# Altium schematic sheet NRF24_Tester.SchDoc
size A4
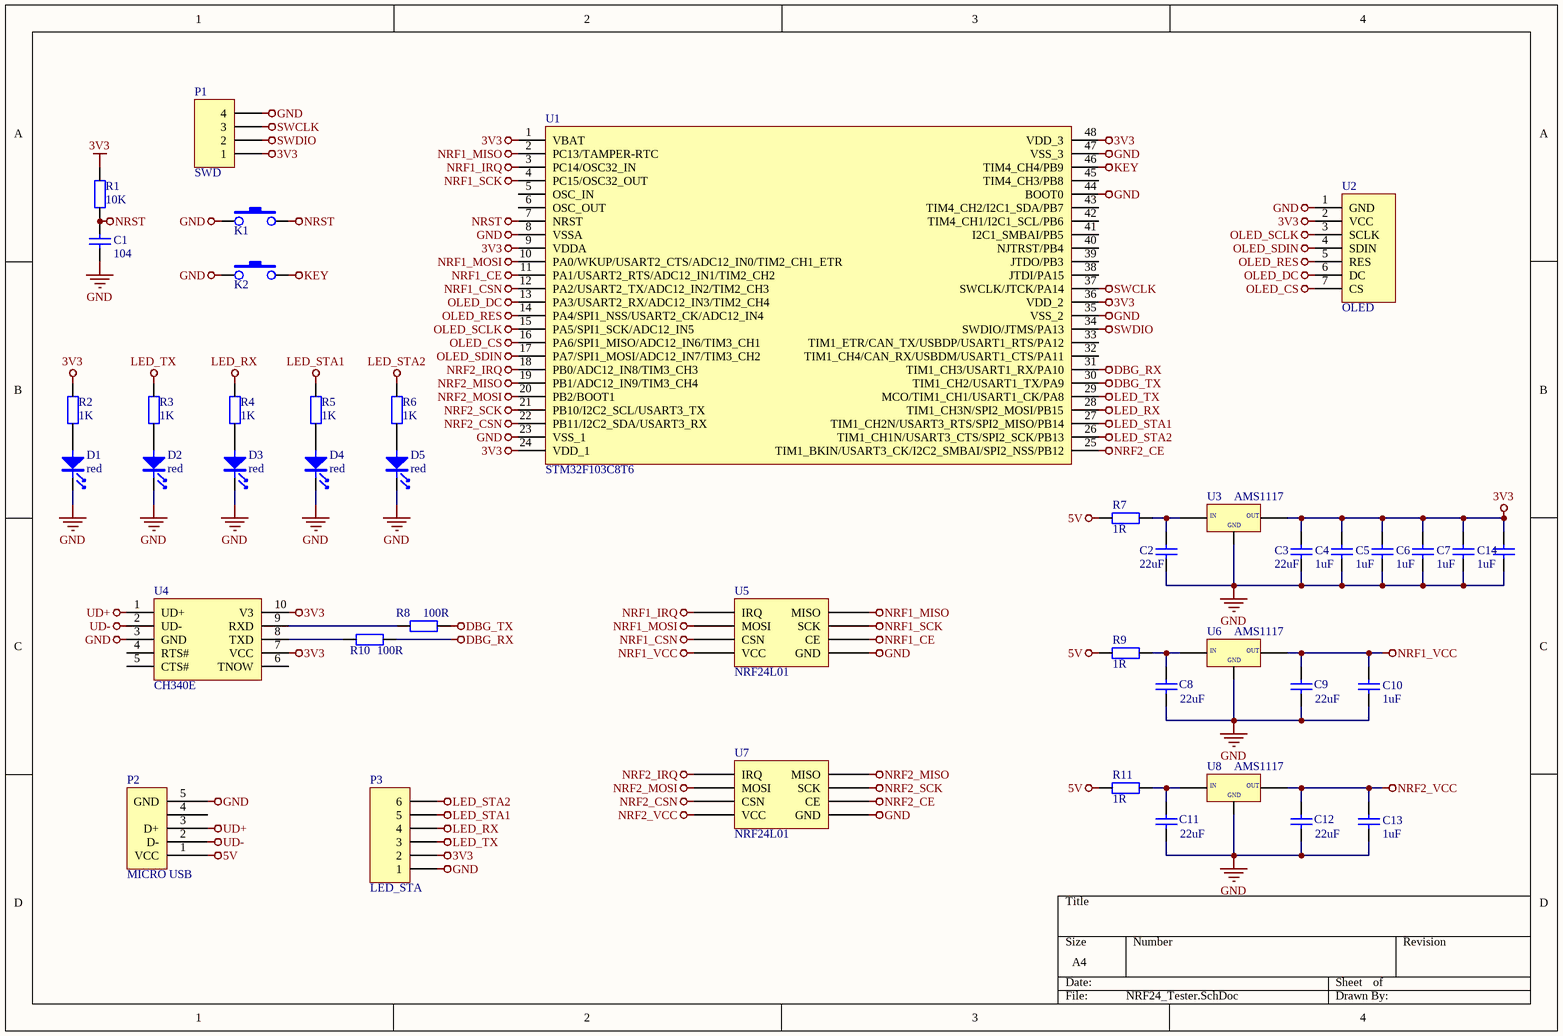
[diagram p0: NRF24_Tester.SchDoc]

## Parts
C1  104  [电容_C0603]
C2  22uF  [电容_C1206]
C3  22uF  [电容_C1206]
C4  1uF  [电容_C0603]
C5  1uF  [电容_C0603]
C6  1uF  [电容_C0603]
C7  1uF  [电容_C0603]
C8  22uF  [电容_C1206]
C9  22uF  [电容_C1206]
C10  1uF  [电容_C0603]
C11  22uF  [电容_C1206]
C12  22uF  [电容_C1206]
C13  1uF  [电容_C0603]
C14  1uF  [电容_C0603]
D1  red  [LED_0603]
D2  red  [LED_0603]
D3  red  [LED_0603]
D4  red  [LED_0603]
D5  red  [LED_0603]
K1  SKRP  [开关按键_SKRP]  (value not drawn)
K2  SKRP  [开关按键_SKRP]  (value not drawn)
P1  SWD  [HDR1X4]
P2  MICRO USB  [接插件_MICRO 牛角插座 USB 直边]
P3  LED_STA  [HDR1X6]
R1  10K  [电阻_R0603]
R2  1K  [电阻_R0603]
R3  1K  [电阻_R0603]
R4  1K  [电阻_R0603]
R5  1K  [电阻_R0603]
R6  1K  [电阻_R0603]
R7  1R  [电阻_R0603]
R8  100R  [电阻_R0603]
R9  1R  [电阻_R0603]
R10  100R  [电阻_R0603]
R11  1R  [电阻_R0603]
U1  STM32F103C8T6  [ST主控_LQFP48]
U2  OLED  [Display_OLED 12864 7pin]
U3  AMS1117  [稳压芯片_SOT-223]
U4  CH340E  [串口_MSOP10]
U5  NRF24L01  [HDR2X4]
U6  AMS1117  [稳压芯片_SOT-223]
U7  NRF24L01  [HDR2X4]
U8  AMS1117  [稳压芯片_SOT-223]

## Nets
3V3: C3.2 C4.2 C5.2 C6.2 C7.2 C14.2 P1.1 P3.2 R1.2 R2.1 U1.1(VBAT) U1.9(VDDA) U1.24(VDD_1) U1.36(VDD_2) U1.48(VDD_3) U2.2(VCC) U3.2(OUT) U4.7(VCC) U4.10(V3)
5V: P2.1(VCC) R7.2 R9.2 R11.2
DBG_RX: R10.1 U1.31(TIM1_CH3/USART1_RX/PA10)
DBG_TX: R8.1 U1.30(TIM1_CH2/USART1_TX/PA9)
GND: C1.1 C2.1 C3.1 C4.1 C5.1 C6.1 C7.1 C8.1 C9.1 C10.1 C11.1 C12.1 C13.1 C14.1 D1.K D2.K D3.K D4.K D5.K K1.1 K2.1 P1.4 P2.0 P2.5(GND) P3.1 U1.8(VSSA) U1.23(VSS_1) U1.35(VSS_2) U1.44(BOOT0) U1.47(VSS_3) U2.1(GND) U3.1(GND) U4.3(GND) U5.1(GND) U6.1(GND) U7.1(GND) U8.1(GND)
KEY: K2.2 U1.46(TIM4_CH4/PB9)
LED_RX: P3.4 R4.1 U1.28(TIM1_CH3N/SPI2_MOSI/PB15)
LED_STA1: P3.5 R5.1 U1.27(TIM1_CH2N/USART3_RTS/SPI2_MISO/PB14)
LED_STA2: P3.6 R6.1 U1.26(TIM1_CH1N/USART3_CTS/SPI2_SCK/PB13)
LED_TX: P3.3 R3.1 U1.29(MCO/TIM1_CH1/USART1_CK/PA8)
NRF1_CE: U1.11(PA1/USART2_RTS/ADC12_IN1/TIM2_CH2) U5.3(CE)
NRF1_CSN: U1.12(PA2/USART2_TX/ADC12_IN2/TIM2_CH3) U5.4(CSN)
NRF1_IRQ: U1.3(PC14/OSC32_IN) U5.8(IRQ)
NRF1_MISO: U1.2(PC13/TAMPER-RTC) U5.7(MISO)
NRF1_MOSI: U1.10(PA0/WKUP/USART2_CTS/ADC12_IN0/TIM2_CH1_ETR) U5.6(MOSI)
NRF1_SCK: U1.4(PC15/OSC32_OUT) U5.5(SCK)
NRF1_VCC: C9.2 C10.2 U5.2(VCC) U6.2(OUT)
NRF2_CE: U1.25(TIM1_BKIN/USART3_CK/I2C2_SMBAI/SPI2_NSS/PB12) U7.3(CE)
NRF2_CSN: U1.22(PB11/I2C2_SDA/USART3_RX) U7.4(CSN)
NRF2_IRQ: U1.18(PB0/ADC12_IN8/TIM3_CH3) U7.8(IRQ)
NRF2_MISO: U1.19(PB1/ADC12_IN9/TIM3_CH4) U7.7(MISO)
NRF2_MOSI: U1.20(PB2/BOOT1) U7.6(MOSI)
NRF2_SCK: U1.21(PB10/I2C2_SCL/USART3_TX) U7.5(SCK)
NRF2_VCC: C12.2 C13.2 U7.2(VCC) U8.2(OUT)
NRST: C1.2 K1.2 R1.1 U1.7(NRST)
OLED_CS: U1.16(PA6/SPI1_MISO/ADC12_IN6/TIM3_CH1) U2.7(CS)
OLED_DC: U1.13(PA3/USART2_RX/ADC12_IN3/TIM2_CH4) U2.6(DC)
OLED_RES: U1.14(PA4/SPI1_NSS/USART2_CK/ADC12_IN4) U2.5(RES)
OLED_SCLK: U1.15(PA5/SPI1_SCK/ADC12_IN5) U2.3(SCLK)
OLED_SDIN: U1.17(PA7/SPI1_MOSI/ADC12_IN7/TIM3_CH2) U2.4(SDIN)
SWCLK: P1.3 U1.37(SWCLK/JTCK/PA14)
SWDIO: P1.2 U1.34(SWDIO/JTMS/PA13)
UD+: P2.3(D+) U4.1(UD+)
UD-: P2.2(D-) U4.2(UD-)
NetC2_2: C2.2 R7.1 U3.3(VIN)
NetC8_2: C8.2 R9.1 U6.3(VIN)
NetC11_2: C11.2 R11.1 U8.3(VIN)
NetD1_A: D1.A R2.2
NetD2_A: D2.A R3.2
NetD3_A: D3.A R4.2
NetD4_A: D4.A R5.2
NetD5_A: D5.A R6.2
NetR8_2: R8.2 U4.9(RXD)
NetR10_2: R10.2 U4.8(TXD)

Not connected (* = marked no-connect by the designer): P2 4; U1 5(OSC_IN) 6(OSC_OUT) 32(TIM1_CH4/CAN_RX/USBDM/USART1_CTS/PA11) 33(TIM1_ETR/CAN_TX/USBDP/USART1_RTS/PA12) 38(JTDI/PA15) 39(JTDO/PB3) 40(NJTRST/PB4) 41(I2C1_SMBAI/PB5) 42(TIM4_CH1/I2C1_SCL/PB6) 43(TIM4_CH2/I2C1_SDA/PB7) 45(TIM4_CH3/PB8); U4 4(RTS#) 5(CTS#) 6(TNOW)

## Notes on the sheet
- (in symbol AMS1117) IN

## Library data of the parts
C1-C14 = cap: U: 50V; 参数: Cap,0805,X7R,104K,50V,125C,±10%
  C1: C: 104
  C2 C3 C8 C9 C11 C12: C: 22uF
  C4-C7 C10 C13 C14: C: 1uF
D1-D5 = LED: 参数: LED,0603,Red
K1 K2 = SW-PB: _Comma: ,; _Name: KEY; _Specification: KEY,SKRP,*; _Footprint: *; _Model: SKRP
P1 = Header 4: Header, 4-Pin; LatestRevisionDate: 17-Jul-2002; LatestRevisionNote: Re-released for DXP Platform.; Publisher: Altium Limited
P2 = MICRO USB 5PIN: _Comma: ,; _Name: Port; _Specification: Port,MICRO USB,5PIN; _Value: 5PIN; _Model: MICRO USB
P3 = Header 6: Header, 6-Pin; LatestRevisionDate: 17-Jul-2002; LatestRevisionNote: Re-released for DXP Platform.; Publisher: Altium Limited
R1-R11 = Res: P: 1/8W; 参数: Res,0805,0R,±1%,1/8W,100ppm,155C
  R1: R: 10K
  R2-R6: R: 1K
  R7 R9 R11: R: 1R
  R8 R10: R: 100R
U1 = STM32F103C8T6: _Footprint: LQFP48; _Comma: ,; _Name: MCU; _Specification: MCU,STM32F103C8T6,LQFP48; _Model: STM32F103C8T6
U2 = OLED 12864 7Pin: _Comma: ,; _Footprint: 7PIN; _Name: Display; _Specification: Display,OLED,OLED 12864,7PIN; _Remarks: OLED 12864; _Model: OLED